# Altium schematic sheet ISO_I2C_ISO1540DR.SchDoc
size A4; SheetNumber: 4; SheetTotal: 10
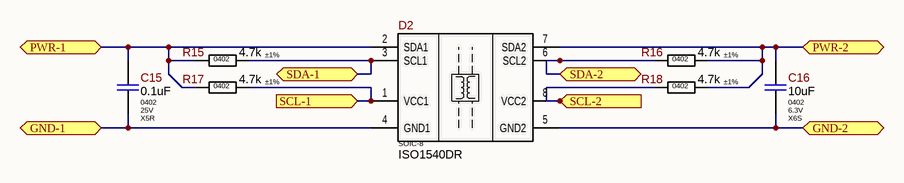
[diagram p0: ISO_I2C_ISO1540DR.SchDoc]

## Parts
C15  Package: 0402  Voltage: 25V  Dielectric Type: X5R  [C_CERAMIC_0402_MED]  (hidden comment: 0.1uF)
C16  Package: 0402  Voltage: 6.3V  Dielectric Type: X6S  [C_CERAMIC_0402_MED]  (hidden comment: 10uF)
D2  Package: SOIC-8  [SOIC-8_W3.9MM]  (hidden comment: ISO1540DR)
R15  Tolerance: ±1%  Package: 0402  [R_ANY_CHIP_0402_MED]  (hidden comment: 4.7k)
R16  Tolerance: ±1%  Package: 0402  [R_ANY_CHIP_0402_MED]  (hidden comment: 4.7k)
R17  Tolerance: ±1%  Package: 0402  [R_ANY_CHIP_0402_MED]  (hidden comment: 4.7k)
R18  Tolerance: ±1%  Package: 0402  [R_ANY_CHIP_0402_MED]  (hidden comment: 4.7k)

## Ports
GND-1 (bidir, see MainShunt[4C]), GND-2 (bidir, see MainShunt[4C]), PWR-1 (bidir, see MainShunt[4C]), PWR-2 (bidir, see MainShunt[4C]), SCL-1 (in, see MainShunt[4C]), SCL-2 (in, see MainShunt[4C]), SDA-1 (bidir, see MainShunt[4C]), SDA-2 (bidir, see MainShunt[4C])

## Nets
GND-1: C15.2 D2.4(GND1) ; port GND-1
GND-2: C16.2 D2.5(GND2) ; port GND-2
PWR-1: C15.1 D2.2(SDA1) R15.1 R17.1 ; port PWR-1
PWR-2: C16.1 D2.7(SDA2) R16.2 R18.2 ; port PWR-2
SCL-1: D2.1(VCC1) R17.2 ; port SCL-1
SCL-2: D2.8(VCC2) R18.1 ; port SCL-2
SDA-1: D2.3(SCL1) R15.2 ; port SDA-1
SDA-2: D2.6(SCL2) R16.1 ; port SDA-2

## Library data of the parts
C15 = Capacitor-NonPolar: 100nF 25V X5R ±10% 0402 Ceramic Capacitor RoHS; Part Number: CL05A104KA5NNNC; Manufacturer: Samsung Electro-Mechanics; Standard Lead Time: 38 Weeks; Component Status: Released; Replacement: NONE; Value: 0.1uF; Part Type: Ceramic / X5R / 0402; Component Type: SMD; Temperature Range: -55°C ~ 85°C; Tolerance: ±10%; ComponentLink1URL: https://eu.mouser.com/datasheet/2/585/MLCC-1837944.pdf; ComponentLink1Description: Datasheet; Price: 0.0013; Supplier 1: Mouser; Supplier Part Number 1: 187-CL05A104KA5NNNC
C16 = Capacitor-NonPolar: 10uF 6.3V X6S ±20% 0402 Ceramic Capacitor RoHS; Part Number: GRM155C80J106ME11D; Manufacturer: Murata Electronics; Component Status: Released; Standard Lead Time: 15 Weeks; Replacement: NONE; Value: 10uF; Part Type: Ceramic / X6S / 0402; Component Type: SMD; Temperature Range: -55°C ~ 105°C; Tolerance: ±20%; ComponentLink1URL: https://search.murata.co.jp/Ceramy/image/img/A01X/G101/ENG/GRM155C80J106ME11-01.pdf; Supplier 1: Digi-Key; Supplier Part Number 1: 490-13233-1-ND; Price: 0.01104; ComponentLink1Description: Datasheet
D2 = ISO1540DR: I2C Digital Isolator 2500Vrms 2 Channel 1Mbps 25kV/us, SOIC-8; Manufacturer: Texas Instruments; Standard Lead Time: 8 Weeks; Replacement: ADUM1250ARZ; Part Number: ISO1540DR; Part Type: Isolator; Component Type: SMD; Temperature Range: -40°C ~ 125°C; ComponentLink1URL: https://www.ti.com/lit/ds/symlink/iso1540.pdf; Supplier 1: Digi-Key; Supplier Part Number 1: 296-34871-2-ND; Price: 1,4064; ComponentLink1Description: Datasheet
R15-R18 = Resistor: 4.7 kOhms ±1% 1/16W 0402 Thick Film Resistor; Part Number: RC0402FR-074K7L; Manufacturer: Yageo; Power Rating: 0.062W; Voltage: 50V; Component Status: Released; Temperature Stability: ±100ppm/°C; Replacement: NONE; Value: 4.7k; Component Type: SMD; Part Type: Thick Film; Temperature Range: -55°C ~ 155°C; ComponentLink1URL: https://eu.mouser.com/datasheet/2/447/PYu_RC_Group_51_RoHS_L_10-1664068.pdf; Price: 0.00065; ComponentLink1Description: Datasheet